# EAGLE design teensyLC-midi-IO_01 (EAGLE 7.5.0)
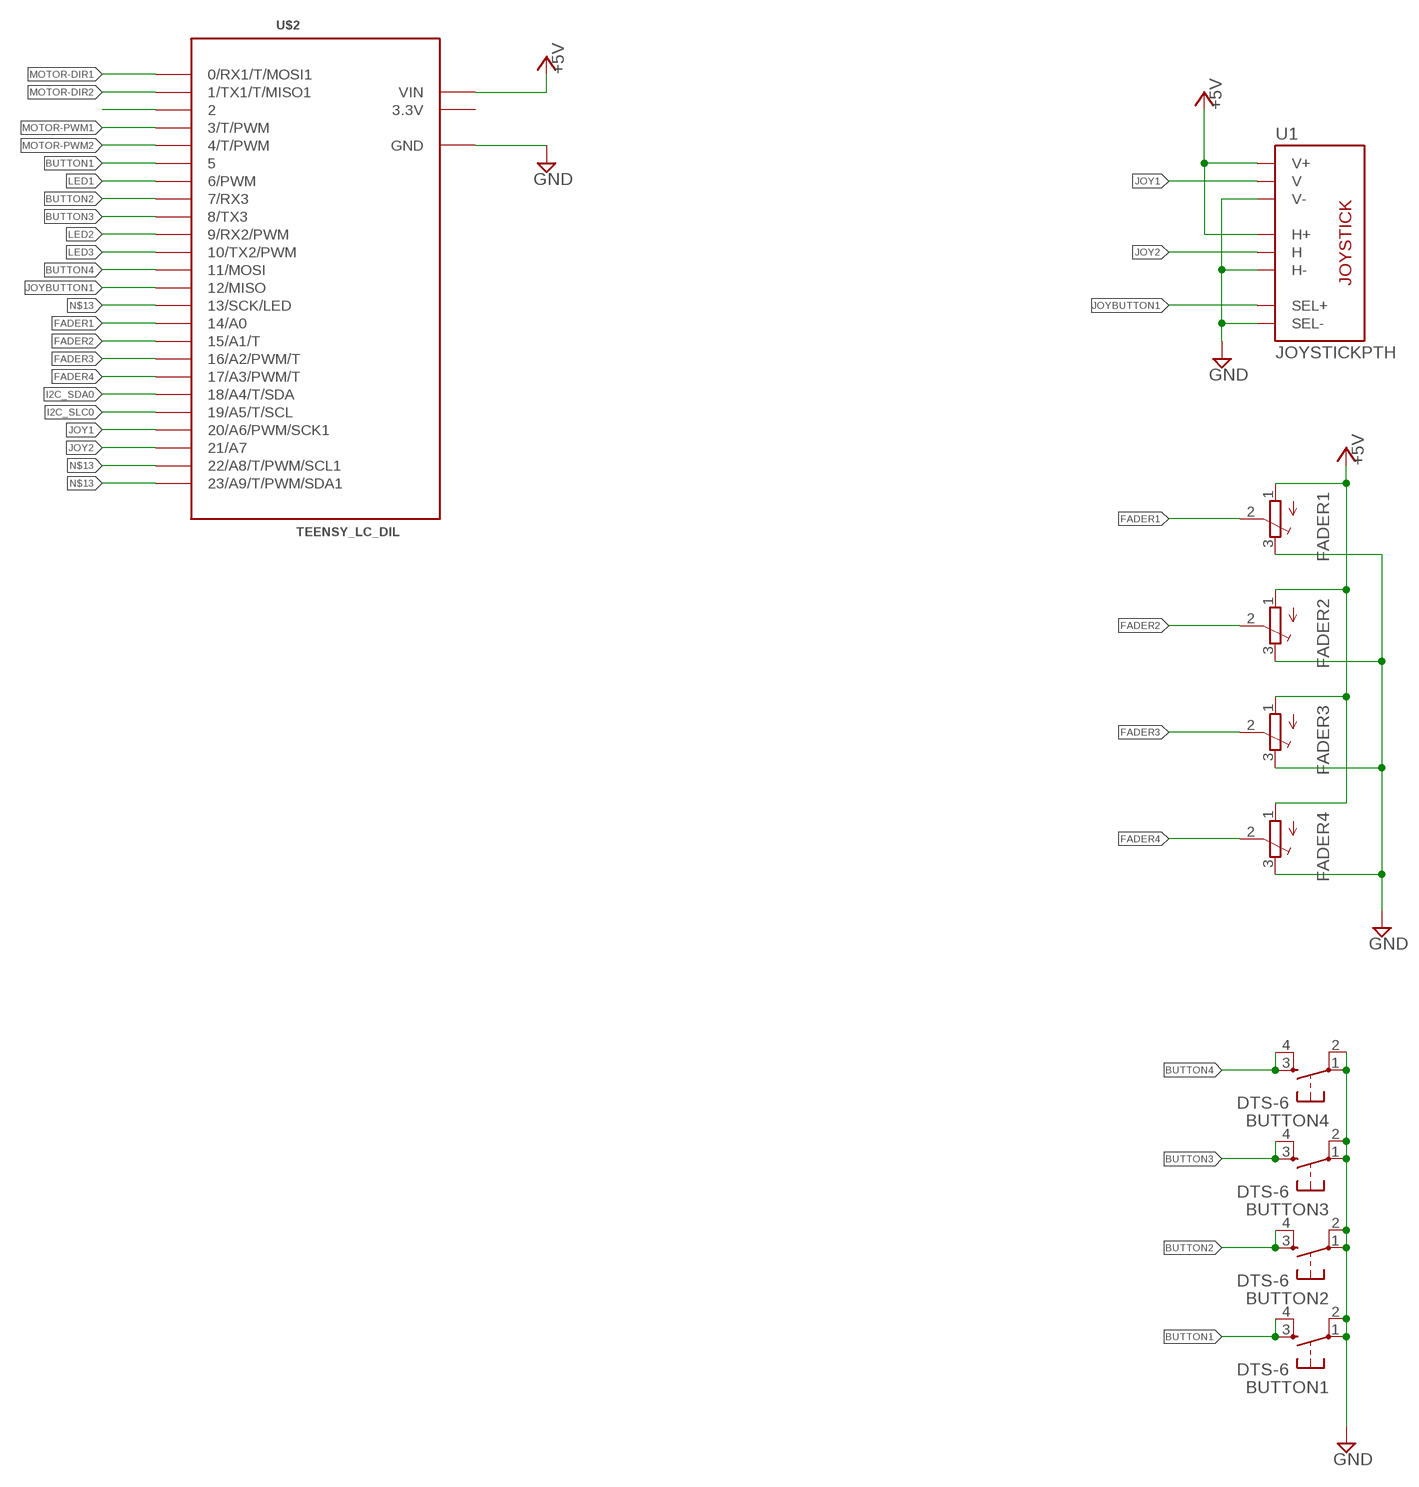
[diagram p0: schematic, sheet 1]

## Parts
BUTTON1  DTS-6  [DTS-6]
BUTTON2  DTS-6  [DTS-6]
BUTTON3  DTS-6  [DTS-6]
BUTTON4  DTS-6  [DTS-6]
FADER1  TRIMPOT3386  [TRIM-3386]
FADER2  TRIMPOT3386  [TRIM-3386]
FADER3  TRIMPOT3386  [TRIM-3386]
FADER4  TRIMPOT3386  [TRIM-3386]
U1  JOYSTICKPTH  [JOYSTICK]
U$2  TEENSY_LC_DIL  [TEENSY_3.0-3.2&LC_DIL]

## Nets
+5V [Power]: FADER1.1(A) FADER2.1(A) FADER3.1(A) FADER4.1(A) U1.H1(H+) U1.V1(V+) U$2.VIN
BUTTON1: BUTTON1.3 BUTTON1.4 U$2.2 U$2.5
BUTTON2: BUTTON2.3 BUTTON2.4 U$2.7(7/RX3)
BUTTON3: BUTTON3.3 BUTTON3.4 U$2.8(8/TX3)
BUTTON4: BUTTON4.3 BUTTON4.4 U$2.11(11/MOSI)
FADER1: FADER1.2(S) U$2.14/A0
FADER2: FADER2.2(S) U$2.15/A1(15/A1/T)
FADER3: FADER3.2(S) U$2.16/A2(16/A2/PWM/T)
FADER4: FADER4.2(S) U$2.17/A3(17/A3/PWM/T)
GND [GND]: BUTTON1.1 BUTTON1.2 BUTTON2.1 BUTTON2.2 BUTTON3.1 BUTTON3.2 BUTTON4.1 BUTTON4.2 FADER1.3(E) FADER2.3(E) FADER3.3(E) FADER4.3(E) U1.B2A(SEL-) U1.H3(H-) U1.V3(V-) U$2.AGND(GND) U$2.GND
I2C_SDA0: U$2.18/A4(18/A4/T/SDA)
I2C_SLC0: U$2.19/A5(19/A5/T/SCL)
JOY1: U1.V2(V) U$2.20/A6(20/A6/PWM/SCK1)
JOY2: U1.H2(H) U$2.21/A7
JOYBUTTON1: U1.B1A(SEL+) U$2.12(12/MISO)
LED1: U$2.6(6/PWM)
LED2: U$2.9(9/RX2/PWM)
LED3: U$2.10(10/TX2/PWM)
MOTOR-DIR1: U$2.0(0/RX1/T/MOSI1)
MOTOR-DIR2: U$2.1(1/TX1/T/MISO1)
MOTOR-PWM1: U$2.3(3/T/PWM)
MOTOR-PWM2: U$2.4(4/T/PWM)
N$13: U$2.13(13/SCK/LED) U$2.22/A8(22/A8/T/PWM/SCL1) U$2.23/A9(23/A9/T/PWM/SDA1)

## Power pins joined to a net without a drawn wire
3.3V: U$2.3.3V

## Library data of the parts
BUTTON1-BUTTON4 = switch-tact:DTS-6
FADER1-FADER4 = adafruit:TRIMPOT: SMT trimmer potentiometer part number TC33X http://www.ladyada.net/library/eagle
U1 = adafruit:JOYSTICK: Thumb Joystick Joystick commonly found in PS2 controllers. Two pots and a select switch. Adapted from Sparkfun Library (but for more common 6mm switch sticks)
U$2 = Teensy_3_and_LC_Series_Boards_v1.4:TEENSY_LC_DIL

## Net classes
0 default: width 0.152 mm, clearance 0.152 mm
1 GND: width 0.508 mm, clearance 0.152 mm
2 Power: width 0.508 mm, clearance 0.152 mm

## Board
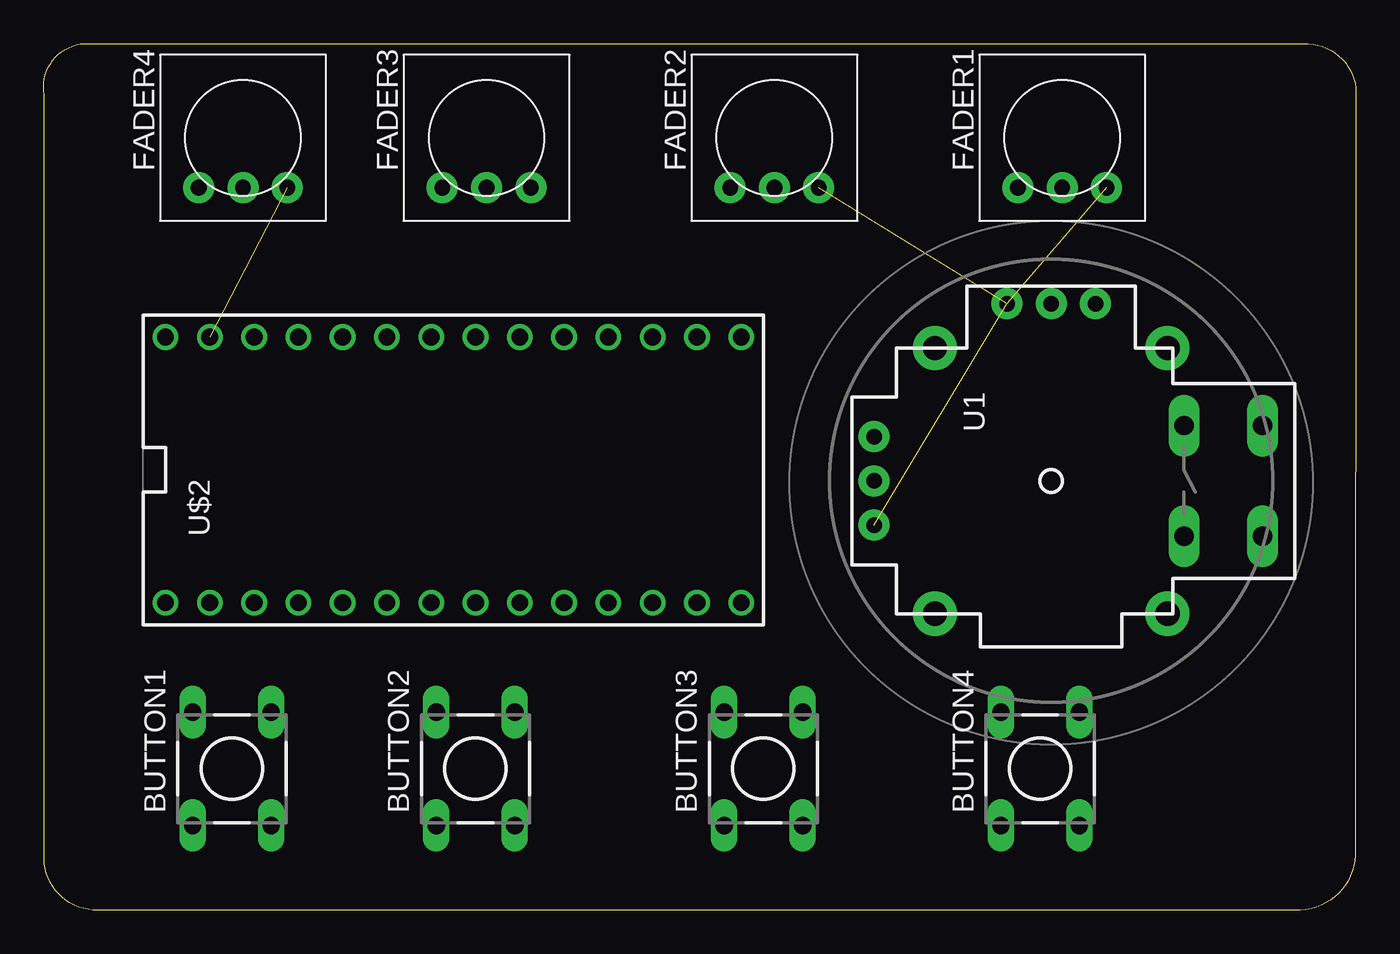
[diagram p1: board, top side]
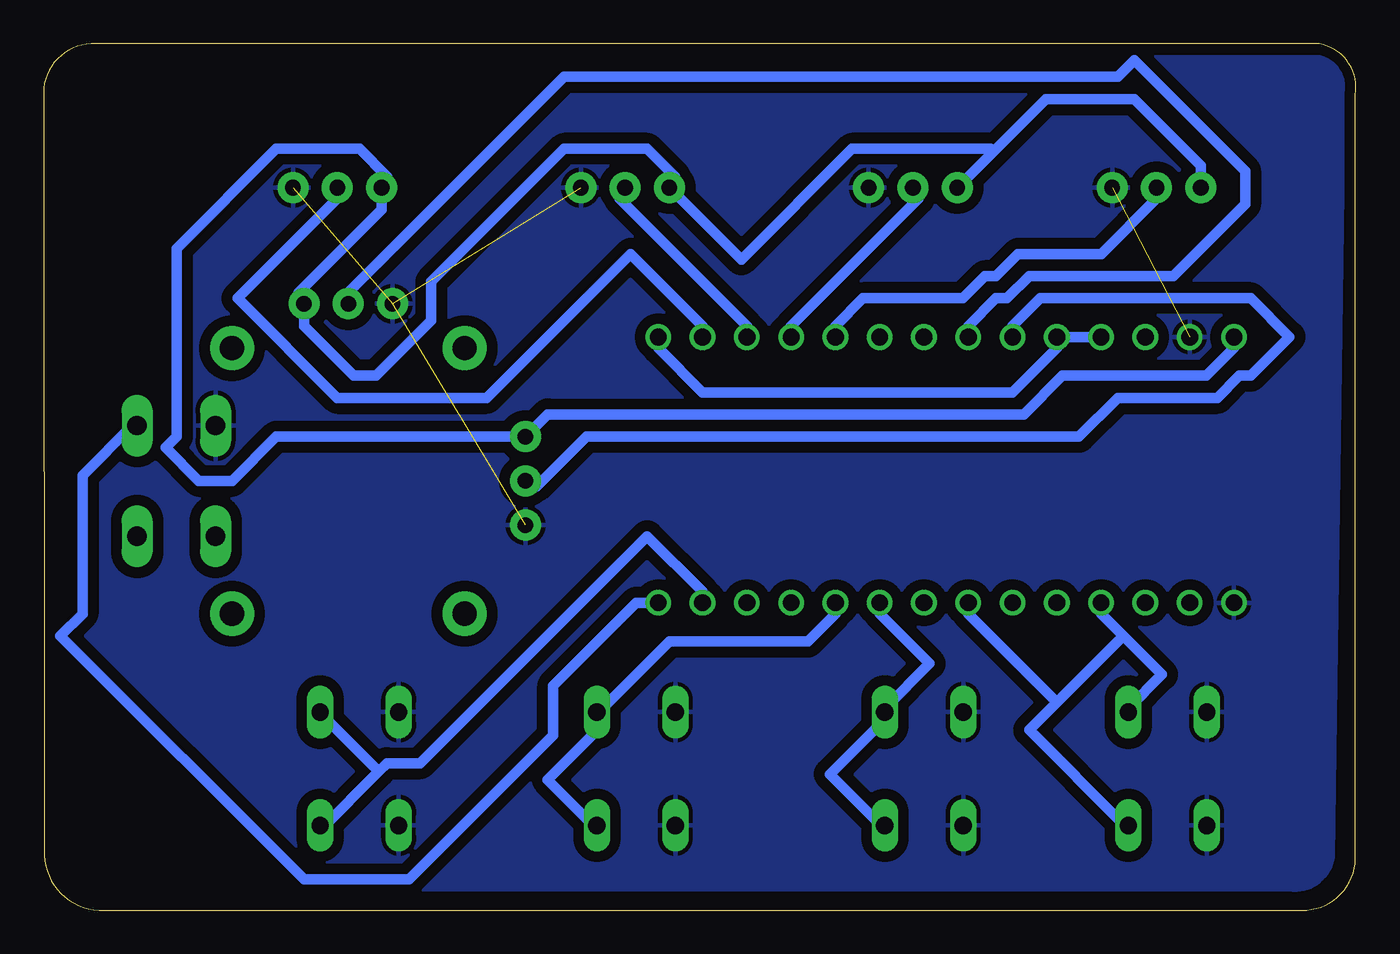
[diagram p2: board, bottom side, seen from below]

Size 75.27 x 49.72 mm. Coordinates in mm from the lower left corner, seen from the top.
Outline: 75.24,3.15 arc-90 71.79,0 2.83,0.01 arc-90 0.04,3.22 0.04,46.79 arc-90 2.09,49.7 72.01,49.7 arc-90 75.27,47.17 75.24,3.15
Copper layers (1*16): Top 0.035mm / dielectric 1.5mm / Bottom 0.035mm
Design rules "default *": minimum track width 24mil, minimum drill 24mil, track to track 24mil, track to pad 16mil, pad to pad 16mil, via to via 6mil, smd to smd 6mil, copper to edge 24mil, drill to drill 24mil, minimum pad ring 10mil, minimum via ring 8mil, stop-mask expansion 4mil, vias tented up to drill 0mil, thermal gap 10mil

### Footprints (pad centres in the part's own frame; a part is rotated, then mirrored left to right if it is on the bottom)
DTS-6 = drill 1 long: 1 -3.25,2.25; 2 3.25,2.25; 3 -3.25,-2.25; 4 3.25,-2.25
TRIM-3386 = drill 0.9 pad 1.778: 1 -2.54,-2.857; 2 0,-2.857; 3 2.54,-2.857
JOYSTICK = drill 1.1 pad 1.778 long: B1A -3.175,12.12; B1B 3.175,12.12; B2A -3.175,7.62; B2B 3.175,7.62 | drill 0.889 pad 1.778: H1 -2.54,-10.16; H2 0,-10.16; H3 2.54,-10.16; V1 -10.16,2.54; V2 -10.16,0; V3 -10.16,-2.54 | drill 1.397 pad 2.54: MOUNT1 -7.62,6.668; MOUNT2 -7.62,-6.668; MOUNT3 7.62,-6.668; MOUNT4 7.62,6.668
TEENSY_3.0-3.2&LC_DIL = drill 0.965: 0 -7.62,13.97; 1 -7.62,11.43; 2 -7.62,8.89; 3 -7.62,6.35; 3.3V 7.62,11.43; 4 -7.62,3.81; 5 -7.62,1.27; 6 -7.62,-1.27; 7 -7.62,-3.81; 8 -7.62,-6.35; 9 -7.62,-8.89; 10 -7.62,-11.43; 11 -7.62,-13.97; 12 -7.62,-16.51; 13 7.62,-16.51; 14/A0 7.62,-13.97; 15/A1 7.62,-11.43; 16/A2 7.62,-8.89; 17/A3 7.62,-6.35; 18/A4 7.62,-3.81; 19/A5 7.62,-1.27; 20/A6 7.62,1.27; 21/A7 7.62,3.81; 22/A8 7.62,6.35; 23/A9 7.62,8.89; AGND 7.62,13.97; GND -7.62,16.51; VIN 7.62,16.51

### Placement (x,y rotation side)
BUTTON1  10.8,8.12 90 top
BUTTON2  24.77,8.12 90 top
BUTTON3  41.28,8.12 90 top
BUTTON4  57.16,8.12 90 top
FADER1  58.43,44.31 0 top
FADER2  41.92,44.31 0 top
FADER3  25.41,44.31 0 top
FADER4  11.44,44.31 0 top
U1  57.79,24.63 270 top
U$2  23.5,25.26 90 top

### Tracks (layer width: path | path; a pad name or v marks a point on that pad's centre or on a via)
+5V
  Bottom 0.61: U$2.VIN 6.99,32.25 8.58,30.66 16.84,30.66 19.06,28.44 46.36,28.44 U1.H1 61.92,27.17 64.46,24.63 66.36,24.63 68.27,26.53 67.63,27.17 67.63,37.96 61.92,43.68 57.16,43.68 55.57,42.09 55.89,41.77 FADER1.1 55.89,40.18 60.65,35.42 60.33,35.1 U1.V1 60.33,33.52 57.47,30.66 56.21,30.66 53.03,33.83 53.03,36.06 45.41,43.68 40.65,43.68 39.06,42.09 39.38,41.77 FADER2.1 35.25,37.33 28.9,43.68 20.96,43.68 20.8,43.52 | FADER4.1 8.9,42.72 12.71,46.53 17.79,46.53 20.8,43.52 | FADER3.1 20.8,43.52
BUTTON1
  Bottom 0.61: U$2.2 14.61,17.01 13.34,15.74 | 13.34,15.74 11.12,13.51 13.02,11.61 BUTTON1.4 | U$2.5 22.23,17.01 17.15,11.93 | 13.34,15.74 17.15,11.93 | 17.15,11.93 18.74,10.34 13.34,4.94 BUTTON1.3
BUTTON2
  Bottom 0.61: U$2.7 27.31,17.01 24.46,14.15 27,11.61 BUTTON2.4 27,11.29 27,10.98 30.17,7.8 27.31,4.94 BUTTON2.3
BUTTON3
  Bottom 0.61: U$2.8 29.85,17.01 31.44,15.42 39.38,15.42 43.5,11.29 BUTTON3.4 43.5,10.98 43.5,10.34 46.36,7.48 43.82,4.94 BUTTON3.3
BUTTON4
  Bottom 0.61: U$2.11 37.47,18.28 40.65,21.45 53.67,8.43 55.57,8.43 56.05,7.96 | 56.05,7.96 59.38,4.63 BUTTON4.3 | 56.05,7.96 59.38,11.29 BUTTON4.4
FADER1
  Bottom 0.61: U$2.14/A0 37.47,33.52 41.6,37.64 49.85,29.39 58.43,29.39 64.14,35.1 58.43,40.82 FADER1.2
FADER2
  Bottom 0.61: U$2.15/A1 34.93,33.52 42.24,40.82 41.92,41.14 FADER2.2
FADER3
  Bottom 0.61: U$2.16/A2 32.39,33.52 25.09,40.82 25.41,41.14 FADER3.2
FADER4
  Bottom 0.61: U$2.17/A3 29.85,33.52 28.26,35.1 22.55,35.1 21.28,36.38 20.64,36.38 19.37,37.64 14.61,37.64 11.44,40.82 FADER4.2
GND  (4 unrouted)
  pour Bottom: 0.64,47.23 1.28,3.04 arc90 3.82,1.13 71.76,1.13 arc90 74.3,4.94 74.3,47.23 arc90 73.03,49.14 2.55,49.14 arc90
JOY1
  Bottom 0.61: U$2.20/A6 22.23,33.52 20.64,35.1 20.01,35.1 18.74,36.38 10.49,36.38 6.36,40.5 6.36,42.41 12.71,48.76 13.66,47.81 45.41,47.81 57.79,35.42 U1.V2
JOY2
  Bottom 0.61: U$2.21/A7 19.69,33.52 18.1,35.1 6.04,35.1 3.82,32.88 6.04,30.66 6.68,30.66 7.94,29.39 13.66,29.39 15.88,27.17 44.14,27.17 47,24.31 47.32,24.63 U1.H2
JOYBUTTON1
  Bottom 0.61: U$2.12 41.28,17.64 46.04,12.88 46.04,10.02 54.3,1.77 60.33,1.77 74.3,15.74 73.03,17.01 73.03,24.94 70.18,27.8 U1.B1A
N$13
  Bottom 0.61: U$2.23/A9 U$2.22/A8 17.15,32.25 19.69,29.71 37.47,29.71 40.01,32.25 U$2.13